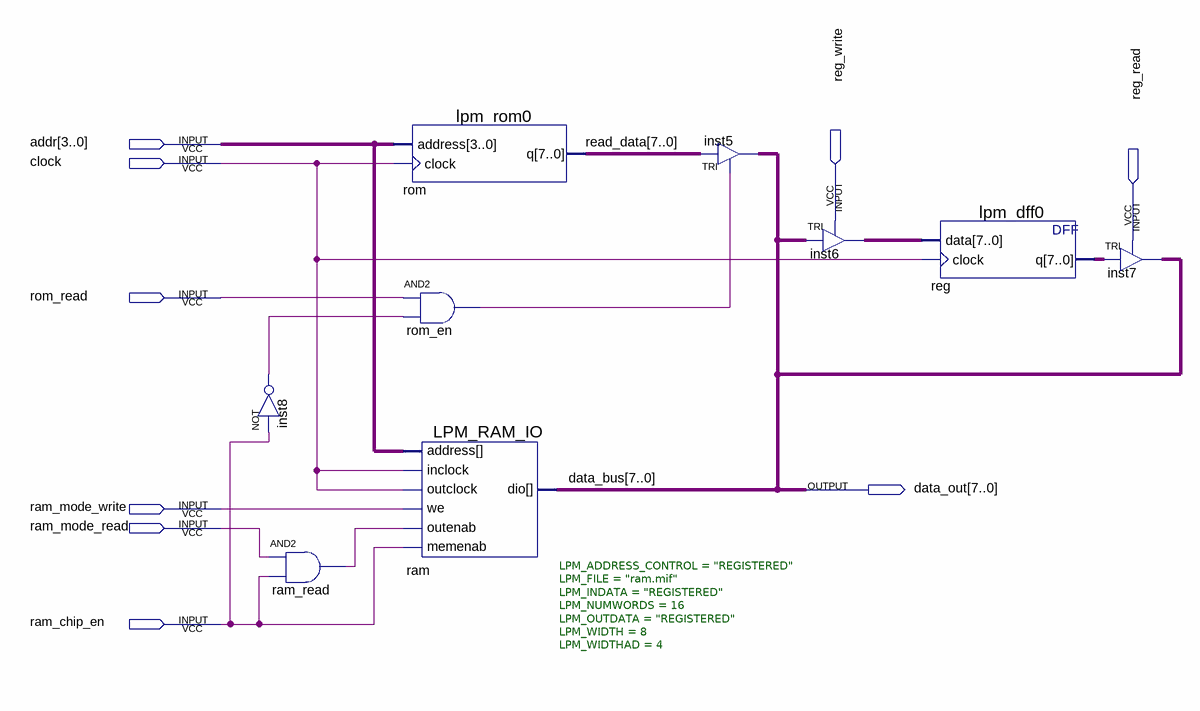
[diagram p0: schematic sheet]
// Quartus schematic rom_ram_interface.bdf as structural Verilog: 9 symbols, 9 pins
module rom_ram_interface (
  input  [3:0] addr,
  input  clock,
  input  reg_write,
  input  reg_read,
  input  rom_read,
  input  ram_mode_write,
  input  ram_mode_read,
  input  ram_chip_en,
  output [7:0] data_out
);

  wire inst8_out, ram_read_out, rom_en_out;
  wire [7:0] read_data, reg_data, reg_q;

  not inst8 (inst8_out, ram_chip_en);
  and ram_read (ram_read_out, ram_mode_read, ram_chip_en);
  lpm_rom0 rom (.address(addr), .clock(clock), .q(read_data));
  and rom_en (rom_en_out, rom_read, inst8_out);
  LPM_RAM_IO #(.LPM_ADDRESS_CONTROL("REGISTERED"), .LPM_FILE("ram.mif"), .LPM_INDATA("REGISTERED"), .LPM_NUMWORDS(16), .LPM_OUTDATA("REGISTERED"), .LPM_WIDTH(8), .LPM_WIDTHAD(4)) ram (
    .address(addr), .outclock(clock), .memenab(ram_chip_en), .inclock(clock), .we(ram_mode_write),
    .outenab(ram_read_out), .dio(data_out));
  TRI inst5[7:0] (.IN(read_data), .OE(rom_en_out), .OUT(data_out));
  TRI inst6[7:0] (.IN(data_out), .OE(reg_write), .OUT(reg_data));
  lpm_dff0 \reg  (.data(reg_data), .clock(clock), .q(reg_q));
  TRI inst7[7:0] (.IN(reg_q), .OE(reg_read), .OUT(data_out));

  // Other names for the same wires on the sheet: data_bus[7:0] = data_out
endmodule
